# EAGLE schematic polyvoks_vcf (EAGLE 7.1.0)
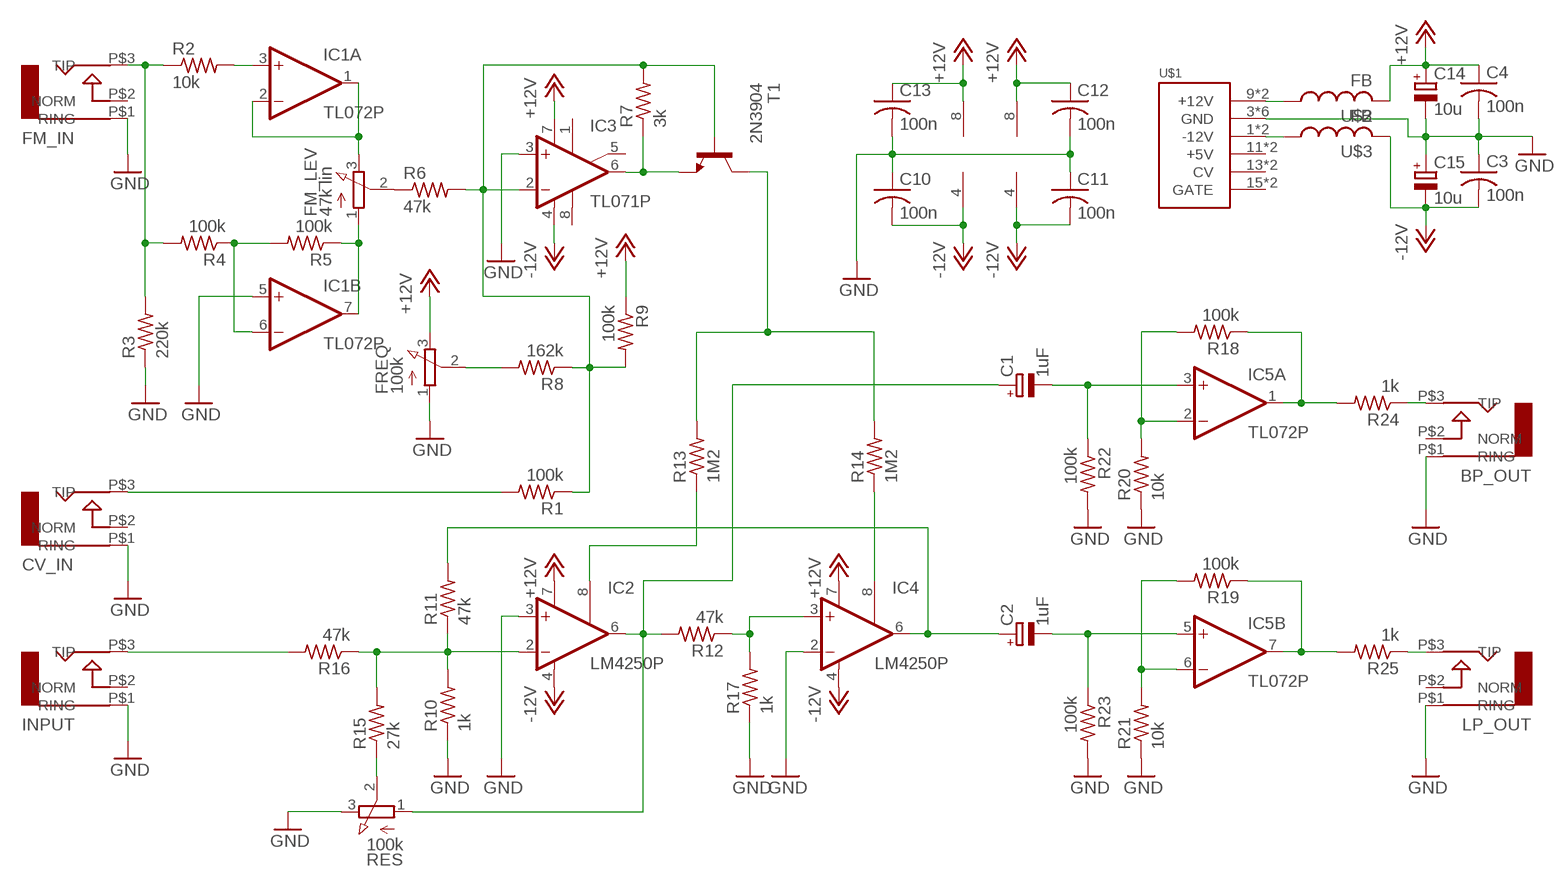
[diagram p0: schematic, sheet 1]

## Parts
BP_OUT  AUDIO-JACK  [ERTHENVAR-JACK-90DEG]
C1  1uF  CPOL-EUB45181C  [B45181C]
C2  1uF  CPOL-EUB45181C  [B45181C]
C3  100n  C-US050-024X044  [C050-024X044]
C4  100n  C-US050-024X044  [C050-024X044]
C10  100n  C-US075-032X103  [C075-032X103]
C11  100n  C-US050-024X044  [C050-024X044]
C12  100n  C-US050-024X044  [C050-024X044]
C13  100n  C-US050-024X044  [C050-024X044]
C14  10u  CPOL-EUB45181A  [B45181A]
C15  10u  CPOL-EUB45181A  [B45181A]
CV_IN  AUDIO-JACK  [ERTHENVAR-JACK-90DEG]
FM_IN  AUDIO-JACK  [ERTHENVAR-JACK-90DEG]
FM_LEV  47k lin  PTD901  [PTD901]
FREQ  100k  3RP/1610N  [3RP/1610N]
IC1  TL072P  [DIL08]
IC2  LM4250P  [DIL08]
IC3  TL071P  [DIL08]
IC4  LM4250P  [DIL08]
IC5  TL072P  [DIL08]
INPUT  AUDIO-JACK  [ERTHENVAR-JACK-90DEG]
LP_OUT  AUDIO-JACK  [ERTHENVAR-JACK-90DEG]
R1  100k  R-US_0207/10  [0207/10]
R2  10k  R-US_0207/10  [0207/10]
R3  220k  R-US_0207/10  [0207/10]
R4  100k  R-US_0207/10  [0207/10]
R5  100k  R-US_0207/10  [0207/10]
R6  47k  R-US_0207/10  [0207/10]
R7  3k  R-US_0207/10  [0207/10]
R8  162k  R-US_0207/10  [0207/10]
R9  100k  R-US_0207/10  [0207/10]
R10  1k  R-US_0207/10  [0207/10]
R11  47k  R-US_0207/10  [0207/10]
R12  47k  R-US_0207/10  [0207/10]
R13  1M2  R-US_0207/10  [0207/10]
R14  1M2  R-US_0207/10  [0207/10]
R15  27k  R-US_0207/10  [0207/10]
R16  47k  R-US_0207/10  [0207/10]
R17  1k  R-US_0207/10  [0207/10]
R18  100k  R-US_0207/10  [0207/10]
R19  100k  R-US_0207/10  [0207/10]
R20  10k  R-US_0207/10  [0207/10]
R21  10k  R-US_0207/10  [0207/10]
R22  100k  R-US_0207/10  [0207/10]
R23  100k  R-US_0207/10  [0207/10]
R24  1k  R-US_0207/10  [0207/10]
R25  1k  R-US_0207/10  [0207/10]
RES  100k  3RP/1610N  [3RP/1610N]
T1  2N3904  [TO92]
U$1  POWER  [POWER_16]
U$2  FB  [FB]
U$3  FB  [FB]

## Nets
+12V: C4.1 C12.1 C13.1 C14.+ FREQ.3(E) IC1.8(P:V+) IC2.7(V+) IC3.7(V+) IC4.7(V+) IC5.8(P:V+) R9.1 U$2.P$2
-12V: C3.2 C10.2 C11.2 C15.- IC1.4(P:V-) IC2.4(V-) IC3.4(V-) IC4.4(V-) IC5.4(P:V-) U$3.P$2
N$1: IC1.3(A:+IN) R2.2
N$2: FM_LEV.3(E) IC1.1(A:OUT) IC1.2(A:-IN)
N$3: FM_IN.P$3(TIP) R2.1 R3.2 R4.2
N$4: FREQ.2(S) R8.2
N$5: CV_IN.P$3(TIP) R1.2
N$6: FM_LEV.1(A) IC1.7(B:OUT) R5.1
N$7: IC1.6(B:-IN) R4.1 R5.2
N$8: BP_OUT.P$3(TIP) R24.1
N$9: FM_LEV.2(S) R6.1
N$10: IC2.2(-IN) R10.2 R11.1 R15.2 R16.1
N$11: C2.+ IC4.6(OUT) R11.2
N$12: R15.1 RES.2(S)
N$13: C1.+ IC2.6(OUT) R12.2 RES.1(A)
N$14: IC3.2(-IN) R1.1 R6.2 R7.2 R8.1 R9.2 T1.2(B)
N$15: IC3.6(OUT) R7.1 T1.3(E)
N$16: IC4.3(+IN) R12.1 R17.2
N$17: R13.2 R14.2 T1.1(C)
N$18: IC2.8(ISET) R13.1
N$19: IC4.8(ISET) R14.1
N$20: INPUT.P$3(TIP) R16.2
N$21: C1.- IC5.3(A:+IN) R22.1
N$22: IC5.2(A:-IN) R18.2 R20.2
N$23: C2.- IC5.5(B:+IN) R23.1
N$24: IC5.6(B:-IN) R19.2 R21.2
N$25: U$1.9(+12V) U$1.10(+12V) U$2.P$1
N$26: U$1.1(-12V) U$1.2(-12V) U$3.P$1
N$27: IC5.7(B:OUT) R19.1 R25.2
N$28: LP_OUT.P$3(TIP) R25.1
N$29: IC5.1(A:OUT) R18.1 R24.2
N$30: BP_OUT.P$1(RING) C3.1 C4.2 C10.1 C11.1 C12.2 C13.2 C14.- C15.+ CV_IN.P$1(RING) FM_IN.P$1(RING) FREQ.1(A) IC1.5(B:+IN) IC2.3(+IN) IC3.3(+IN) IC4.2(-IN) INPUT.P$1(RING) LP_OUT.P$1(RING) R3.1 R10.1 R17.1 R20.1 R21.1 R22.2 R23.2 RES.3(E) U$1.3(GND) U$1.4(GND) U$1.5(GND) U$1.6(GND) U$1.7(GND) U$1.8(GND) ; supply symbol labelled GND
Unconnected: BP_OUT.P$2(NORM) CV_IN.P$2(NORM) FM_IN.P$2(NORM) IC3.1(ON1) IC3.5(ON2) IC3.8(OPT) INPUT.P$2(NORM) LP_OUT.P$2(NORM) U$1.11(+5V) U$1.12(+5V) U$1.13(CV) U$1.14(CV) U$1.15(GATE) U$1.16(GATE)

## Library data of the parts
BP_OUT CV_IN FM_IN INPUT LP_OUT = erthenvar:AUDIO-JACK: Switching Mono 3.5mm Audio Jack from Erthenvar.
C1 C2 C14 C15 = rcl:CPOL-EU: POLARIZED CAPACITOR, European symbol
C3 C4 C10-C13 = rcl:C-US: CAPACITOR, American symbol
FM_LEV = bourns_ptd:PTD901: 16mm Potentiometer one level Source: http://www.alphapotentiometers.net/html/16mm_pot_2.html
FREQ RES = pot:3RP/1610N: 16mm Potentiometer one level Source: http://www.alphapotentiometers.net/html/16mm_pot_2.html
IC1 IC5 = linear:TL072: OP AMP
IC2 IC4 = LM4250:LM4250: OP AMP
IC3 = linear:TL071: OP AMP
R1-R25 = rcl:R-US_: RESISTOR, American symbol
T1 = transistor:2N3904: NPN TRANSISTOR
U$1 = eurorack:POWER
U$2 U$3 = adafruit:FB: Ferrite bead Digikey #P9821BK-ND